# Altium schematic sheet [1] - schemitic blockdiagram.SchDoc
size A4; Organization: Altium Limited; Address1: L3, 12a Rodborough Rd; Address2: Frenchs Forest; Address3: NSW; Address4: Australia 2086
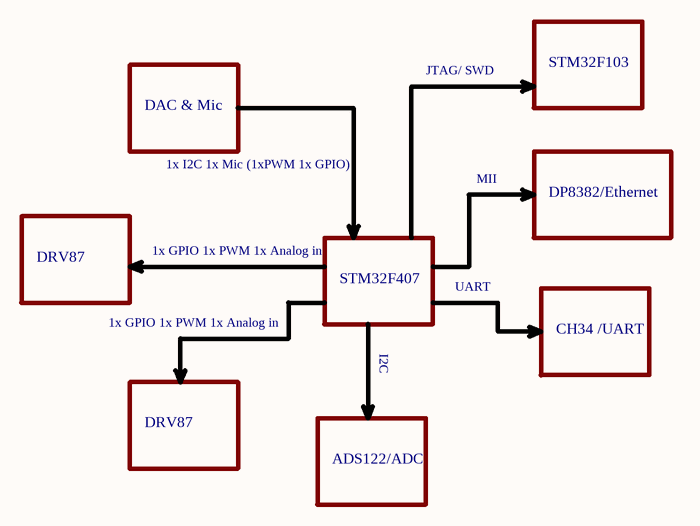
[diagram p0: [1] - schemitic blockdiagram.SchDoc]

## Notes on the sheet
- JTAG/ SWD
- STM32F103
- DAC & Mic
- 1x I2C 1x Mic (1xPWM 1x GPIO)
- MII
- DP8382/Ethernet
- DRV87
- 1x GPIO 1x PWM 1x Analog in
- STM32F407
- UART
- I2C
- CH34 /UART
- ADS122/ADC
- Title
- Size:
- Date:
- A4
- Number:
- Time:
- Revision:
- Sheet
- of
- File: